# EAGLE design ArduinoStandaloneUsbSwitch-V2 (EAGLE 7.4.0)
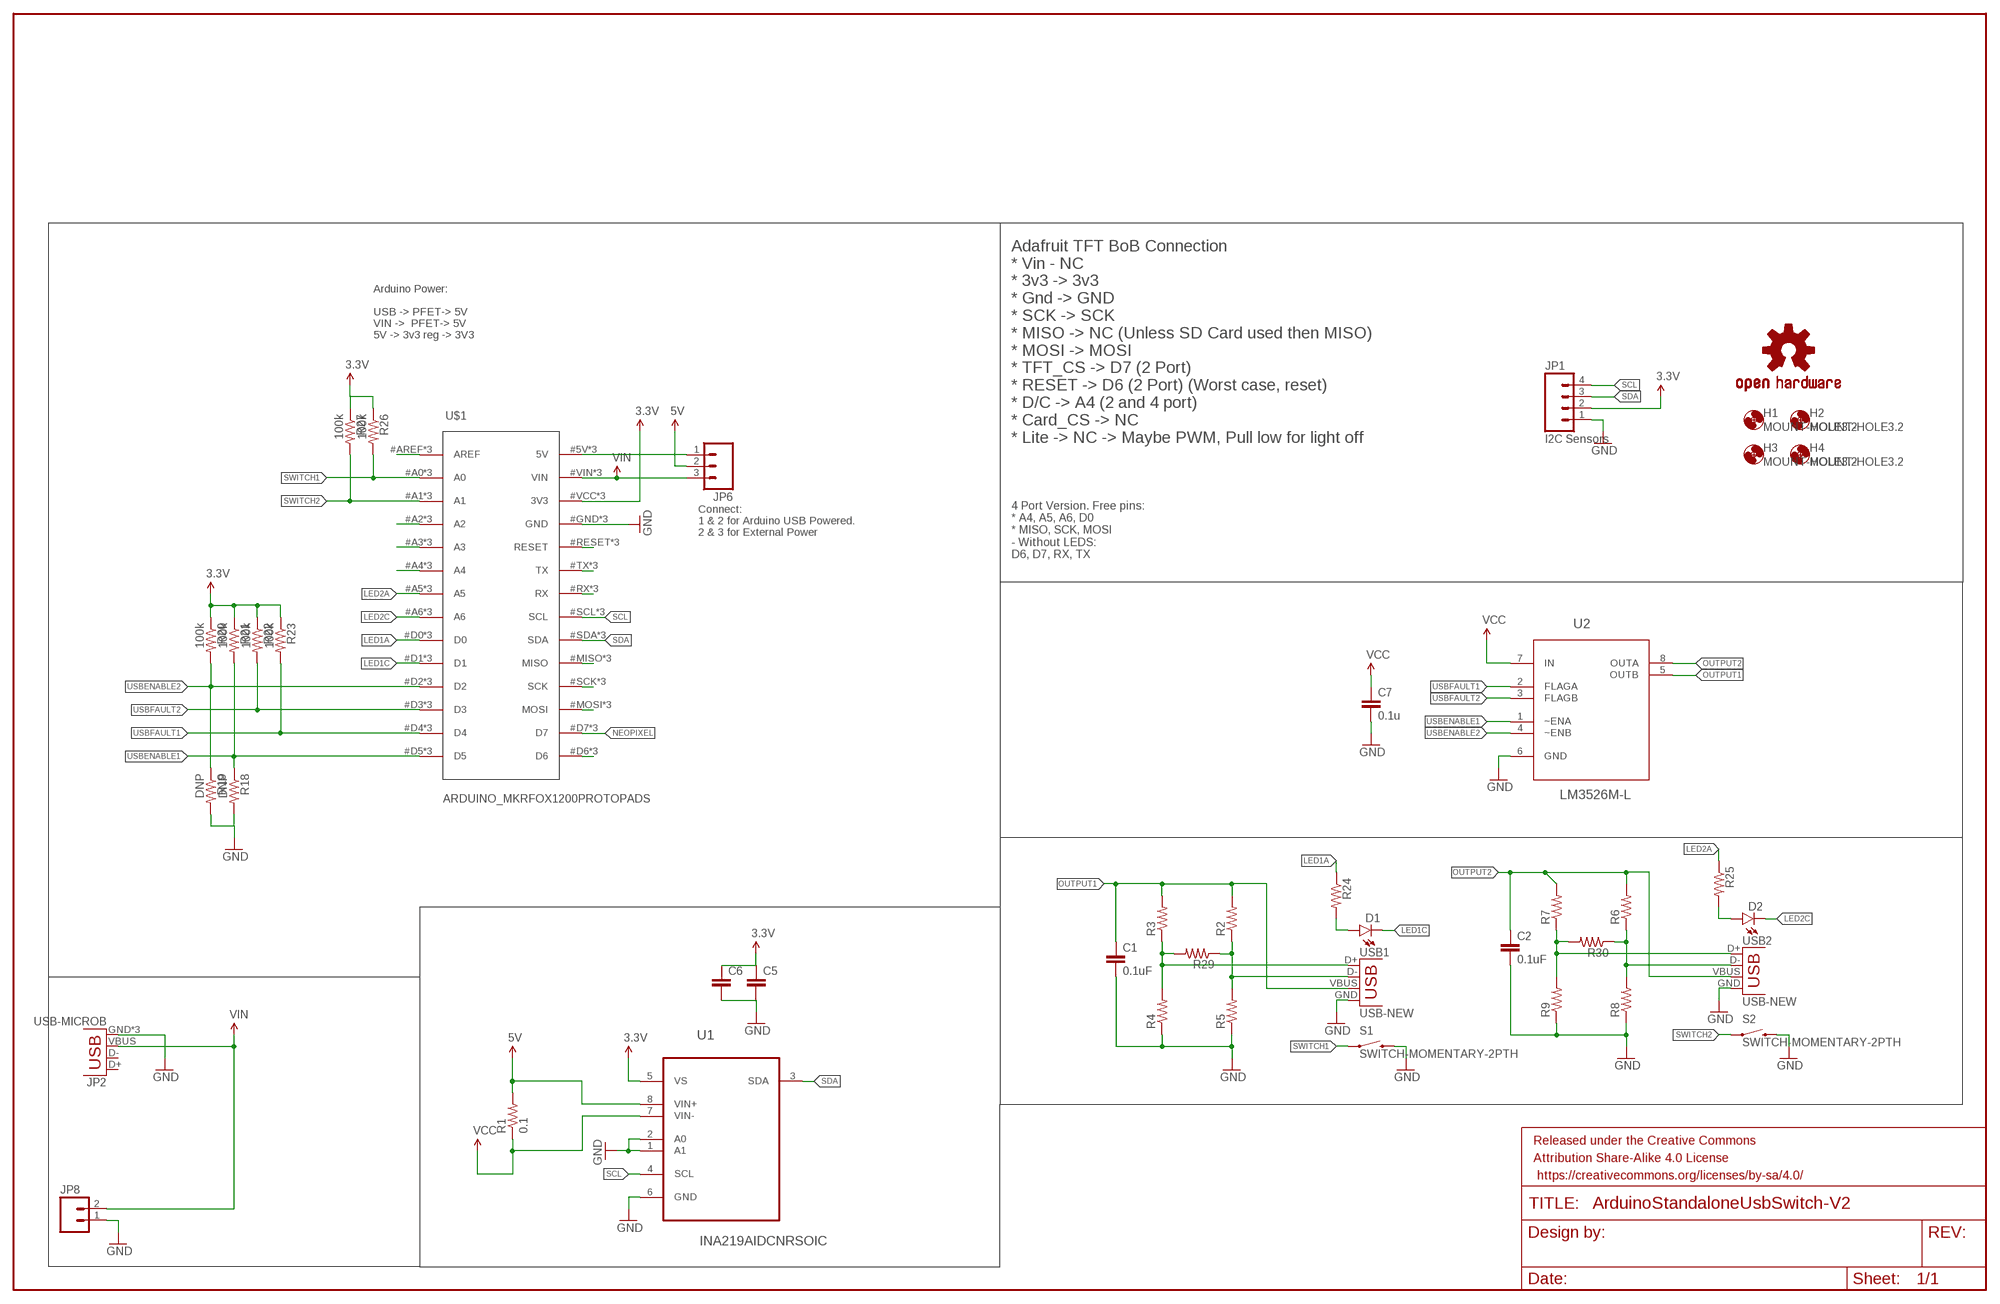
[diagram p0: schematic, sheet 1]

## Parts
C1  0.1uF  CAP0805  [0805]
C2  0.1uF  CAP0805  [0805]
C5  CAP0805  [0805]
C6  CAP0805  [0805]
C7  0.1u  CAP0805  [0805]
D1  LED3MM  [LED3MM]
D2  LED3MM  [LED3MM]
FRAME1  FRAME-LEDGER  [CREATIVE_COMMONS]
H1  MOUNT-HOLE3.2  [3,2]
H2  MOUNT-HOLE3.2  [3,2]
H3  MOUNT-HOLE3.2  [3,2]
H4  MOUNT-HOLE3.2  [3,2]
JP1  I2C Sensors  M04POLAR  [MOLEX-1X4]
JP2  USB-MICROB  [USB-MICROB]
JP6  M03PTH  [1X03]
JP8  M025MM  [SCREWTERMINAL-5MM-2]
LOGO1  OSHW-LOGOM  [OSHW-LOGO-M]
R1  0.1  0.001OHM-3W-1%(2512)3W/1%  [2512]
R2  RESISTOR0805-RES  [0805]
R3  RESISTOR0805-RES  [0805]
R4  RESISTOR0805-RES  [0805]
R5  RESISTOR0805-RES  [0805]
R6  RESISTOR0805-RES  [0805]
R7  RESISTOR0805-RES  [0805]
R8  RESISTOR0805-RES  [0805]
R9  RESISTOR0805-RES  [0805]
R18  DNP  RESISTOR0805-RES  [0805]
R19  DNP  RESISTOR0805-RES  [0805]
R20  100k  RESISTOR0805-RES  [0805]
R21  100k  RESISTOR0805-RES  [0805]
R22  100k  RESISTOR0805-RES  [0805]
R23  100k  RESISTOR0805-RES  [0805]
R24  RESISTOR0805-RES  [0805]
R25  RESISTOR0805-RES  [0805]
R26  100k  RESISTOR0805-RES  [0805]
R27  100k  RESISTOR0805-RES  [0805]
R29  RESISTOR0805-RES  [0805]
R30  RESISTOR0805-RES  [0805]
S1  SWITCH-MOMENTARY-2PTH  [TACTILE-PTH]
S2  SWITCH-MOMENTARY-2PTH  [TACTILE-PTH]
U1  INA219AIDCNRSOIC  [SO08]
U2  LM3526M-L  [SOIC127P640X175-8N]
U$1  ARDUINO_MKRFOX1200PROTOPADS  [ARDUINO_MKRFOX1200_PROTOPADS]
USB1  USB-NEW  [USB-A-VERTICAL]
USB2  USB-NEW  [USB-A-VERTICAL]

## Nets
3.3V: C5.1 C6.1 JP1.2 R20.1 R21.1 R22.1 R23.1 R26.1 R27.1 U1.5(VS) U$1.#VCC(3V3) U$1.@VCC(3V3) U$1.VCC(3V3)
5V: JP6.2 R1.2 U1.8(VIN+)
GND: C1.2 C2.2 C5.2 C6.2 C7.2 JP1.1 JP2.GND JP2.MT1(GND) JP2.MT2(GND) JP8.1 R4.1 R5.1 R8.1 R9.1 R18.2 R19.2 S1.3 S2.3 U1.1(A1) U1.2(A0) U1.6(GND) U2.6(GND) U$1.#GND(GND) U$1.@GND(GND) U$1.GND USB1.GND USB2.GND
LED1A: R24.1 U$1.#D0(D0) U$1.@D0(D0) U$1.D0
LED1C: D1.K(C) U$1.#D1(D1) U$1.@D1(D1) U$1.D1
LED2A: R25.1 U$1.#A5(A5) U$1.@A5(A5) U$1.A5
LED2C: D2.K(C) U$1.#A6(A6) U$1.@A6(A6) U$1.A6
N$3: JP6.1 U$1.5V U$1.#5V(5V) U$1.@5V(5V)
N$4: D1.A R24.2
N$6: D2.A R25.2
N$7: U$1.#RESET(RESET) U$1.@RESET(RESET) U$1.RESET
N$8: U$1.#TX(TX) U$1.@TX(TX) U$1.TX
N$9: U$1.#RX(RX) U$1.@RX(RX) U$1.RX
N$10: R3.1 R4.2 R29.2 USB1.D+
N$11: U$1.#MISO(MISO) U$1.@MISO(MISO) U$1.MISO
N$12: U$1.#SCK(SCK) U$1.@SCK(SCK) U$1.SCK
N$13: R2.1 R5.2 R29.1 USB1.D-
N$14: U$1.#MOSI(MOSI) U$1.@MOSI(MOSI) U$1.MOSI
N$15: U$1.#D6(D6) U$1.@D6(D6) U$1.D6
N$16: U$1.#A4(A4) U$1.@A4(A4) U$1.A4
N$17: U$1.#A3(A3) U$1.@A3(A3) U$1.A3
N$18: R6.1 R8.2 R30.1 USB2.D-
N$19: U$1.#A2(A2) U$1.@A2(A2) U$1.A2
N$20: U$1.#AREF(AREF) U$1.@AREF(AREF) U$1.AREF
NEOPIXEL: U$1.#D7(D7) U$1.@D7(D7) U$1.D7
OUTPUT1: C1.1 R2.2 R3.2 U2.5(OUTB) USB1.VBUS
OUTPUT2: C2.1 R6.2 R7.2 U2.8(OUTA) USB2.VBUS
SCL: JP1.4 U1.4(SCL) U$1.#SCL(SCL) U$1.@SCL(SCL) U$1.SCL
SDA: JP1.3 U1.3(SDA) U$1.#SDA(SDA) U$1.@SDA(SDA) U$1.SDA
SWITCH1: R26.2 S1.1 U$1.#A0(A0) U$1.@A0(A0) U$1.A0
SWITCH2: R27.2 S2.1 U$1.#A1(A1) U$1.@A1(A1) U$1.A1
USB2D-: R7.1 R9.2 R30.2 USB2.D+
USBENABLE1: R18.1 R21.2 U2.1(~ENA) U$1.#D5(D5) U$1.@D5(D5) U$1.D5
USBENABLE2: R19.1 R20.2 U2.4(~ENB) U$1.#D2(D2) U$1.@D2(D2) U$1.D2
USBFAULT1: R23.2 U2.2(FLAGA) U$1.#D4(D4) U$1.@D4(D4) U$1.D4
USBFAULT2: R22.2 U2.3(FLAGB) U$1.#D3(D3) U$1.@D3(D3) U$1.D3
VCC: C7.1 R1.1 U1.7(VIN-) U2.7(IN)
VIN: JP2.VBUS JP6.3 JP8.2 U$1.#VIN(VIN) U$1.@VIN(VIN) U$1.VIN
Unconnected: JP2.D+ JP2.D-

## Notes on the sheet
- Arduino Power: 
  
  USB -> PFET-> 5V
  VIN ->  PFET-> 5V
  5V -> 3v3 reg -> 3V3
- Adafruit TFT BoB Connection
  * Vin - NC
  * 3v3 -> 3v3
  * Gnd -> GND
  * SCK -> SCK
  * MISO -> NC (Unless SD Card used then MISO)
  * MOSI -> MOSI
  * TFT_CS -> D7 (2 Port)
  * RESET -> D6 (2 Port) (Worst case, reset)
  * D/C -> A4 (2 and 4 port)
  * Card_CS -> NC
  * Lite -> NC -> Maybe PWM, Pull low for light off
- Connect:
  1 & 2 for Arduino USB Powered.
  2 & 3 for External Power
- 4 Port Version. Free pins:
  * A4, A5, A6, D0
  * MISO, SCK, MOSI
  - Without LEDS:
  D6, D7, RX, TX

## Library data of the parts
C1 C2 C5-C7 = SparkFun-Capacitors:CAP: Capacitor Standard 0603 ceramic capacitor, and 0.1" leaded capacitor.
D1 D2 = SparkFun-LED:LED: LEDs Standard schematic elements and footprints for 5mm, 3mm, 1206, and 0603 sized LEDs. 5mm - Spark Fun Electronics SKU : COM-00529 (and others)
FRAME1 = SparkFun-Aesthetics:FRAME-LEDGER: Schematic Frame Standard 11x14 US Ledger frame
H1-H4 = holes:MOUNT-HOLE: MOUNTING HOLE with drill center marker
JP1 = SparkFun-Connectors:M04: Header 4 Standard 4-pin 0.1" header. Use with straight break away headers (SKU : PRT-00116), right angle break away headers (PRT-00553), swiss pins (PRT-00743), machine pins (PRT-00117), and female headers (PRT-00115). Molex polarized connector foot print use with SKU : PRT-08231 with associated crimp pins and housings. 1MM SMD Version SKU: PRT-10208
JP2 = SparkFun-Connectors:USB: USB Connectors USB-B-PTH is fully proven SKU : PRT-00139/CONN-08278 USB-miniB is fully proven SKU : PRT-00587 USB-A-PCB is untested. USB-A-H is throughly reviewed, but untested. Spark Fun Electronics SKU : PRT-00437 USB-B-SMT is throughly reviewed, but untested. Needs silkscreen touching up. USB-A-S has not been used/tested USB-MB-H has not been used/tested USB-MICROB has been used. CONN-09505; PROD_ID: CONN-09505
JP6 = SparkFun-Connectors:M03: Header 3 Standard 3-pin 0.1" header. Use with straight break away headers (SKU : PRT-00116), right angle break away headers (PRT-00553), swiss pins (PRT-00743), machine pins (PRT-00117), and female headers (PRT-00115). Molex polarized connector foot print use with SKU : PRT-08232 with associated crimp pins and housings.
JP8 = SparkFun-Connectors:M02: Standard 2-pin 0.1" header. Use with - straight break away headers ( PRT-00116) - right angle break away headers (PRT-00553) - swiss pins (PRT-00743) - machine pins (PRT-00117) - female headers (PRT-00115) Molex polarized connector foot print use with: PRT-08233 with associated crimp pins and housings. 2.54_SCREWTERM for use with PRT-10571. 3.5mm Screw Terminal footprints for PRT-08084 5mm Screw Terminal footprints for use with PRT-08432; STOREFRONT_ID: PRT-08432
LOGO1 = SparkFun-Aesthetics:OSHW-LOGO: Open Source Hardware Logo This logo indicates the piece of hardware it is found on incorporates a OSHW license and/or adheres to the definition of open source hardware found here: http://freedomdefined.org/OSHW
R1 = SparkFun-Resistors:0.001OHM-3W-1%(2512); PROD_ID: RES-12449; VALUE: 0.001
R2-R9 R18-R27 R29 R30 = SparkFun-Resistors:RESISTOR: Resistor Basic schematic elements and footprints for 0603, 1206, and PTH resistors.
S1 S2 = SparkFun-Electromechanical:SWITCH-MOMENTARY-2: Various NO switches- pushbuttons, reed, etc; PROD_ID: SWCH-08441
U1 = INA219AIDCNR:INA219AIDCNR: CURRENT/POWER MONITOR
U2 = LM3256M-L:LM3526M-L: Dual Port USB Power Switch; MPN: LM3526M-L; OC_FARNELL: 1469238; OC_NEWARK: 41K4868; PACKAGE: SOIC-8; SUPPLIER: National Semiconductor
U$1 = Arduino:ARDUINO_MKRFOX1200
USB1 USB2 = Tinamous:USB-NEW: USB Connectors USB-B-PTH is fully proven SKU : PRT-00139/CONN-08278 USB-miniB is fully proven SKU : PRT-00587 USB-A-PCB is untested. USB-A-H is throughly reviewed, but untested. Spark Fun Electronics SKU : PRT-00437 USB-B-SMT is throughly reviewed, but untested. Needs silkscreen touching up. USB-A-S has not been used/tested USB-MB-H has not been used/tested USB-MICROB has been used. CONN-09505

## Board
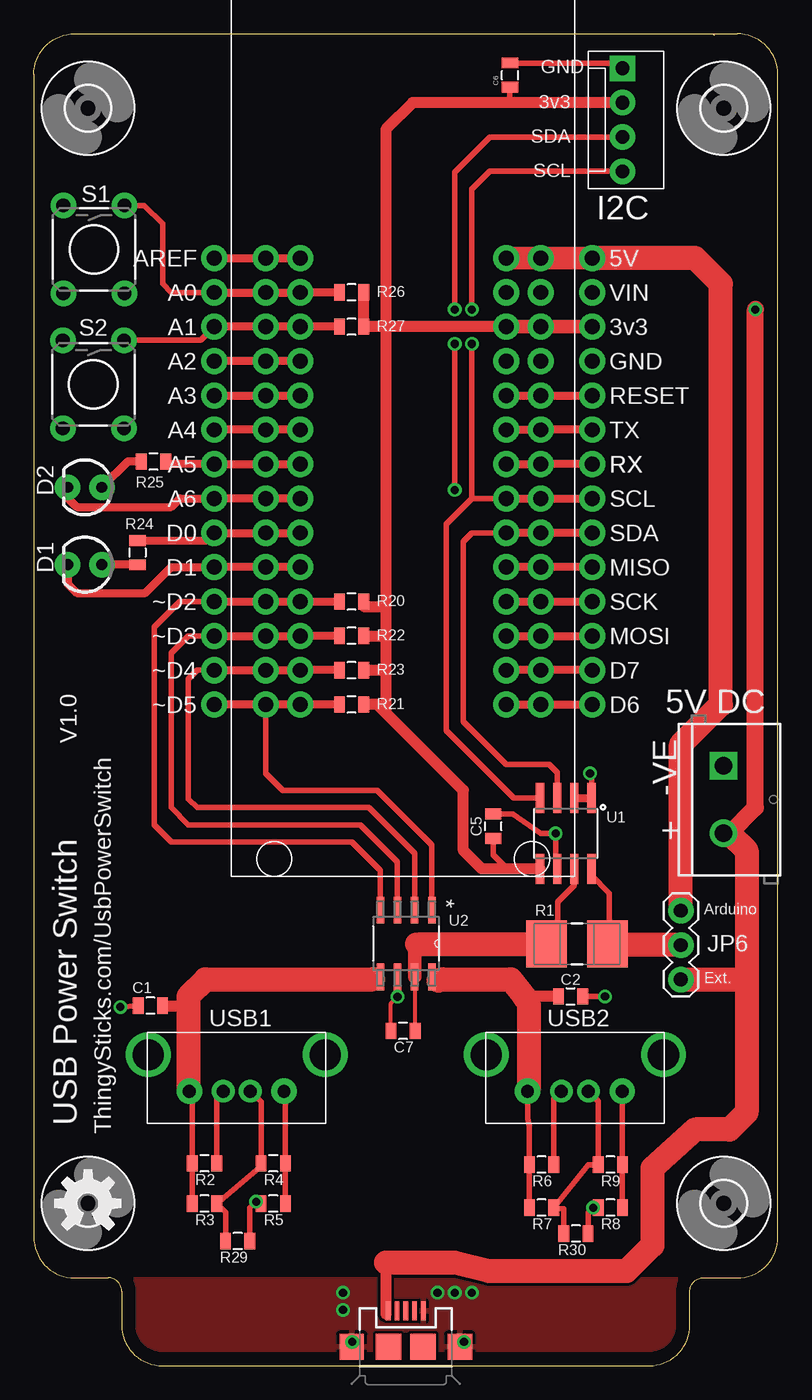
[diagram p1: board, top side]
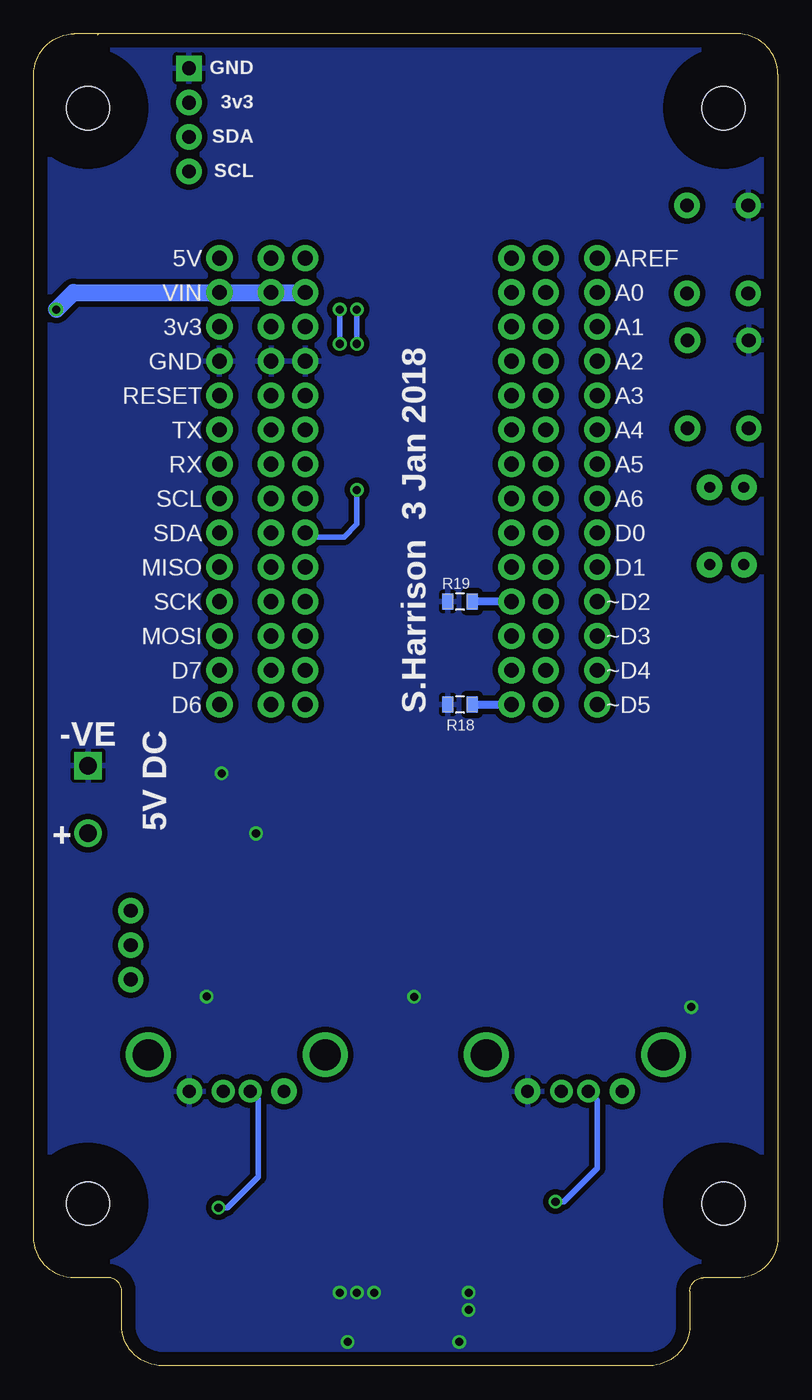
[diagram p2: board, bottom side, seen from below]

Size 55 x 98.5 mm. Coordinates in mm from the lower left corner, seen from the top.
Outline: 49.5,98.5 52,98.5 arc-90 55,95.5 55,9.5 arc-90 52,6.5 49.5,6.5 arc90 48.5,5.5 48.5,3 arc-90 45.5,0 9.5,0 arc-90 6.5,3 6.5,5.5 arc90 5.5,6.5 3,6.5 arc-90 0,9.5 0,95.5 arc-90 3,98.5 50.2,98.5 50.3,98.4
Copper layers (1*16): Top 0.035mm / dielectric 1.5mm / Bottom 0.035mm
Design rules "default": minimum track width 10mil, minimum drill 24mil, track to track 8mil, track to pad 8mil, pad to pad 8mil, via to via 8mil, smd to smd 8mil, copper to edge 40mil, drill to drill 8mil, minimum pad ring 10mil, minimum via ring 8mil, stop-mask expansion 4mil, vias tented up to drill 0mil, thermal gap 10mil

### Footprints (pad centres in the part's own frame; a part is rotated, then mirrored left to right if it is on the bottom)
0805 = smd 0.8 x 1.2: 1 -0.9,0; 2 0.9,0
LED3MM = drill 0.813 pad 1.88: A -1.27,0; K 1.27,0
3,2 = hole 3.2: 0,0
MOLEX-1X4 = drill 1.016 pad 1.88 square: 1 0,0 | drill 1.016 pad 1.88: 2 2.54,0; 3 5.08,0; 4 7.62,0
USB-MICROB = smd 0.35 x 1.4: D+ 0,2.65; D- -0.65,2.65; GND 1.3,2.65; ID 0.65,2.65; VBUS -1.3,2.65 | smd 1.8 x 1.9: MT1 -4,0; MT2 4,0 | smd 1.9 x 1.9: P$1 -1.27,0; P$2 1.27,0
1X03 = drill 1.016 pad 1.88: 1 0,0; 2 2.54,0; 3 5.08,0
SCREWTERMINAL-5MM-2 = drill 1.3 pad 2.032 square: 1 0,0 | drill 1.3 pad 2.032: 2 5,0
2512 = smd 3 x 3.5: 1 -2.25,0; 2 2.25,0
TACTILE-PTH = drill 1.016 pad 1.88: 1 -3.251,2.261; 2 3.251,2.261; 3 -3.251,-2.261; 4 3.251,-2.261
SO08 = smd 0.61 x 2.21: 1 -1.905,-2.616; 2 -0.635,-2.616; 3 0.635,-2.616; 4 1.905,-2.616; 5 1.905,2.616; 6 0.635,2.616; 7 -0.635,2.616; 8 -1.905,2.616
SOIC127P640X175-8N = smd 1.981 x 0.559: 1 -2.464,1.905; 2 -2.464,0.635; 3 -2.464,-0.635; 4 -2.464,-1.905; 5 2.464,-1.905; 6 2.464,-0.635; 7 2.464,0.635; 8 2.464,1.905
ARDUINO_MKRFOX1200_PROTOPADS = drill 1.1 pad 1.93: 5V 22.86,45.72; #5V 20.32,45.72; #A0 5.08,43.18; #A1 5.08,40.64; #A2 5.08,38.1; #A3 5.08,35.56; #A4 5.08,33.02; #A5 5.08,30.48; #A6 5.08,27.94; #AREF 5.08,45.72; #D0 5.08,25.4; #D1 5.08,22.86; #D2 5.08,20.32; #D3 5.08,17.78; #D4 5.08,15.24; #D5 5.08,12.7; #D6 20.32,12.7; #D7 20.32,15.24; #GND 20.32,38.1; #MISO 20.32,22.86; #MOSI 20.32,17.78; #RESET 20.32,35.56; #RX 20.32,30.48; #SCK 20.32,20.32; #SCL 20.32,27.94; #SDA 20.32,25.4; #TX 20.32,33.02; #VCC 20.32,40.64; #VIN 20.32,43.18; @5V 26.67,45.72; @A0 -1.27,43.18; @A1 -1.27,40.64; @A2 -1.27,38.1; @A3 -1.27,35.56; @A4 -1.27,33.02; @A5 -1.27,30.48; @A6 -1.27,27.94; @AREF -1.27,45.72; @D0 -1.27,25.4; @D1 -1.27,22.86; @D2 -1.27,20.32; @D3 -1.27,17.78; @D4 -1.27,15.24; @D5 -1.27,12.7; @D6 26.67,12.7; @D7 26.67,15.24; @GND 26.67,38.1; @MISO 26.67,22.86; @MOSI 26.67,17.78; @RESET 26.67,35.56; @RX 26.67,30.48; @SCK 26.67,20.32; @SCL 26.67,27.94; @SDA 26.67,25.4; @TX 26.67,33.02; @VCC 26.67,40.64; @VIN 26.67,43.18; A0 2.54,43.18; A1 2.54,40.64; A2 2.54,38.1; A3 2.54,35.56; A4 2.54,33.02; A5 2.54,30.48; A6 2.54,27.94; AREF 2.54,45.72; D0 2.54,25.4; D1 2.54,22.86; D2 2.54,20.32; D3 2.54,17.78; D4 2.54,15.24; D5 2.54,12.7; D6 22.86,12.7; D7 22.86,15.24; GND 22.86,38.1; MISO 22.86,22.86; MOSI 22.86,17.78; RESET 22.86,35.56; RX 22.86,30.48; SCK 22.86,20.32; SCL 22.86,27.94; SDA 22.86,25.4; TX 22.86,33.02; VCC 22.86,40.64; VIN 22.86,43.18
USB-A-VERTICAL = drill 0.95 pad 1.676: D+ 2.7,1; D- 2.7,-1 | drill 0.95 pad 1.88: GND 2.7,3.5; VBUS 2.7,-3.5 | drill 2.3: SHLD1 0,-6.55; SHLD2 0,6.55

### Placement (x,y rotation side)
C1  8.62,26.62 180 top
C2  39.69,27.3 0 top
C5  33.97,39.9 90 top
C6  35.2,95.44 90 top
C7  27.3,24.77 180 top
D1  3.77,59.24 180 top
D2  3.77,64.96 180 top
FRAME1  -1.27,-10.16 0 top  (outside the outline)
H1  51,12 0 top
H2  4,12 0 top
H3  51,93 0 top
H4  4,93 0 top
JP1  43.53,95.95 270 top
JP2  27.5,1.4 0 top
JP6  47.84,33.65 270 top
JP8  50.98,44.38 270 top
LOGO1  4,12 0 top
R1  40.16,31.2 0 top
R2  12.62,14.96 180 top
R3  12.62,11.99 180 top
R4  17.7,14.96 180 top
R5  17.7,11.99 180 top
R6  37.54,14.87 180 top
R7  37.54,11.69 180 top
R8  42.62,11.69 180 top
R9  42.62,14.87 180 top
R18  23.5,48.9 180 bottom
R19  23.5,56.52 180 bottom
R20  23.5,56.52 180 top
R21  23.5,48.9 180 top
R22  23.5,53.98 180 top
R23  23.5,51.44 180 top
R24  7.66,60.13 270 top
R25  8.85,66.86 180 top
R26  23.5,79.38 180 top
R27  23.5,76.83 180 top
R29  15.07,9.22 180 top
R30  40.08,9.78 180 top
S1  4.45,82.55 270 top
S2  4.41,72.58 270 top
U1  39.33,39.37 180 top
U2  27.52,31.22 270 top
U$1  14.61,36.2 0 top
USB1  15,23 270 top
USB2  40,23 270 top

### Tracks (layer width: path | path; a pad name or v marks a point on that pad's centre or on a via)
3.3V
  Top 0.305: 24.19,56.77 R20.1 24.45,56.14
  Top 0.406: C5.1 33.97,37.78 34.92,36.83 37.34,36.83 U1.5 | C6.1 35.2,93.68 34.92,93.41
  Top 0.813: U1.5 33.1,36.75 31.75,38.1 31.75,42.55 26.04,48.26 | 26.04,48.26 25.4,48.9 R21.1 | U$1.#VCC 26.04,76.83 | 26.04,76.83 26.04,55.88 | 26.04,55.88 26.04,53.98 | 26.04,53.98 26.04,51.44 | 26.04,51.44 26.04,48.26 | R23.1 26.04,51.44 | R22.1 26.04,53.98 | 24.45,56.14 25.77,56.14 26.04,55.88 | 26.04,76.83 R27.1 R26.1 | JP1.2 34.92,93.41 28,93.41 26.04,91.44 26.04,76.83
  Top 1.016: U$1.#VCC U$1.VCC U$1.@VCC
5V
  Top 0.406: U1.8 41.23,36.24 42.55,34.92 42.55,31.33 R1.2
  Top 1.778: JP6.2 42.41,31.11 R1.2
GND  (via drill 0.6)
  Top 0.305: 23.7,1.61 23.7,1.7 23.5,1.91 23.5,1.27 | C7.2 26.41,26.8 v26.89,27.29
  Top 0.406: R5.1 R4.1 18.6,20.2 USB1.GND | R8.1 R9.1 43.52,15.38 43.5,15.74 USB2.GND | C2.2 v42.23,27.3 | C1.2 v6.4,26.53 | U1.6 38.58,36.86 v38.58,39.36 38.56,39.37 37.47,39.37 35.4,40.8 C5.2 | 40.01,41.94 U1.2 | 41.3,41.91 U1.1 41.23,43.69 v41.12,43.8 | C6.2 43.14,96.34 JP1.1
  Top 0.61: U1.2 U1.1 | U2.6 v26.89,27.29
  Top 1.016: JP2.MT1 23.7,1.61 v23.55,1.76 | v31.8,1.76 31.8,1.5 JP2.MT2
  other vias: 29.84,5.4 31.11,5.4 22.86,5.4 22.86,4.13 32.38,5.4
  pour Bottom (isolate 0.406, rank 6): -0.37,105.77 55.18,105.63 55.38,-0.34 -0.37,-0.44
  pour Top: 4.45,0 4.45,6.35 49.53,6.35 49.53,0
LED1A
  Top 0.61: U$1.#D0 U$1.D0 U$1.@D0 12.78,61.03 R24.1
LED1C
  Top 0.61: U$1.#D1 U$1.D1 U$1.@D1 10.16,59.05 8.26,57.15 3.17,57.15 2.5,57.83 D1.K
LED2A
  Top 0.61: U$1.#A5 U$1.A5 U$1.@A5 9.94,66.67 R25.1
LED2C
  Top 0.61: U$1.#A6 U$1.A6 U$1.@A6 10.79,64.14 10.16,63.5 3.17,63.5 2.5,64.17 D2.K
N$3
  Top 1.676: U$1.#5V U$1.5V U$1.@5V
  Top 1.778: JP6.1 47.84,45.93 50.8,48.9 50.8,80.01 48.9,81.92 U$1.@5V
N$4
  Top 0.61: R24.2 D1.A
N$6
  Top 0.61: R25.2 6.95,66.86 D2.A
N$7
  Top 0.61: U$1.#RESET U$1.RESET U$1.@RESET
N$8
  Top 0.61: U$1.#TX U$1.TX U$1.@TX
N$9
  Top 0.61: U$1.#RX U$1.RX U$1.@RX
N$10
  Top 0.406: R29.2 14.18,11.34 R3.1 16.7,14.66 R4.2 16.8,19.5 USB1.D+
N$11
  Top 0.61: U$1.@MISO U$1.MISO U$1.#MISO
N$12
  Top 0.61: U$1.#SCK U$1.SCK U$1.@SCK
N$13  (via drill 0.6)
  Top 0.406: R5.2 v16.43,12.12 15.97,11.67 R29.1 | R2.1 13.52,19.82 USB1.D-
  Bottom 0.406: v16.43,12.12 15.81,12.12 13.34,14.61 13.34,19.64 USB1.D-
N$14
  Top 0.61: U$1.#MOSI U$1.MOSI U$1.@MOSI
N$15
  Top 0.61: U$1.#D6 U$1.D6 U$1.@D6
N$16
  Top 0.61: U$1.#A4 U$1.A4 U$1.@A4
N$17
  Top 0.61: U$1.@A3 U$1.A3 U$1.#A3
N$18  (via drill 0.6)
  Top 0.406: R8.2 v41.35,11.69 40.98,11.31 R30.1 | R6.1 38.44,19.74 USB2.D-
  Bottom 0.406: v41.35,11.69 40.7,11.69 38.42,13.97 38.42,19.72 USB2.D-
N$19
  Top 0.61: U$1.#A2 U$1.A2 U$1.@A2
N$20
  Top 0.61: U$1.@AREF U$1.AREF U$1.#AREF
NEOPIXEL
  Top 0.61: U$1.@D7 U$1.D7 U$1.#D7
OUTPUT1
  Top 0.406: R3.2 R2.2 11.72,20.08 USB1.VBUS
  Top 0.61: 25.08,28.57 25.43,28.57 U2.5
  Top 0.813: C1.1 11.38,26.62 11.43,26.67
  Top 1.778: 25.08,28.57 12.7,28.57 11.43,27.3 11.43,26.67 11.43,20.37 USB1.VBUS
OUTPUT2
  Top 0.406: R7.2 R6.2 36.64,17.72 36.5,18.28 USB2.VBUS
  Top 0.61: U2.8 30.56,28.3 29.93,28.48
  Top 0.813: C2.1 36.51,27.3 36.35,27.15
  Top 1.778: 29.93,28.48 30.16,28.57 35.24,28.57 36.35,27.15 36.55,26.95 36.6,26.63 36.6,20.52 USB2.VBUS
SCL  (via drill 0.6)
  Top 0.406: U1.4 35.49,41.98 30.48,46.99 30.48,62.23 32.38,64.14 | 32.38,64.14 U$1.#SCL | JP1.4 33.72,88.33 32.38,87 v32.38,78.11 | v32.38,75.56 32.38,64.14
  Top 0.61: U$1.#SCL U$1.SCL U$1.@SCL
  Bottom 0.406: v32.38,78.11 v32.38,75.56
SDA  (via drill 0.6)
  Top 0.406: U1.3 38.69,43.86 38.1,44.45 34.92,44.45 31.75,47.62 31.75,60.96 32.38,61.59 U$1.#SDA | JP1.3 33.72,90.87 31.11,88.27 v31.11,78.11 | v31.11,75.56 v31.11,64.77
  Top 0.61: U$1.@SDA U$1.SDA U$1.#SDA
  Bottom 0.406: v31.11,78.11 v31.11,75.56 | v31.11,64.77 31.11,62.23 32.07,61.28 34.61,61.28 U$1.#SDA
SWITCH1
  Top 0.406: S1.1 8.18,85.8 9.53,84.45 9.53,80.01 10.16,79.38 U$1.@A0
  Top 0.61: U$1.@A0 U$1.A0 U$1.#A0 R26.2
SWITCH2
  Top 0.406: S2.1 12.33,75.83 U$1.@A1
  Top 0.61: U$1.@A1 U$1.A1 U$1.#A1 R27.2
USB2D-
  Top 0.406: R30.2 39.17,11.59 R7.1 40.98,14.87 R9.2 41.74,17.72 41.74,19.56 USB2.D+
USBENABLE1
  Top 0.406: U2.1 29.43,38.52 25.4,42.55 18.41,42.55 17.14,43.81 U$1.D5
  Top 0.61: U$1.@D5 U$1.D5 U$1.#D5 R21.2
  Bottom 0.61: R21.2 U$1.#D5
USBENABLE2
  Top 0.406: U2.4 25.61,36.62 23.5,38.73 10.16,38.73 8.89,40.01 8.89,54.61 10.79,56.52 U$1.@D2
  Top 0.61: U$1.@D2 U$1.D2 U$1.#D2 R20.2
  Bottom 0.61: U$1.#D2 R20.2
USBFAULT1
  Top 0.406: U2.2 28.16,37.88 24.77,41.27 12.06,41.27 11.43,41.91 11.43,50.8 12.06,51.44 U$1.@D4
  Top 0.61: U$1.@D4 U$1.D4 U$1.#D4 R23.2
USBFAULT2
  Top 0.406: U2.3 26.89,37.25 24.13,40.01 11.43,40.01 10.16,41.27 10.16,52.7 11.43,53.98 U$1.@D3
  Top 0.61: U$1.@D3 U$1.D3 U$1.#D3 R22.2
VCC
  Top 0.305: C7.1 28.2,28.71 U2.7
  Top 0.406: U1.7 39.96,35.52 38.73,34.29 38.73,32.02 R1.1
  Top 1.016: U2.7 28.16,30.76 28.57,31.18
  Top 1.676: 28.25,31.18 28.57,31.18
  Top 1.778: 28.57,31.18 37.89,31.18 R1.1
VIN  (via drill 0.6)
  Top 0.406: 26.04,3.81 26.16,3.81 JP2.VBUS
  Top 0.813: 26.04,7.62 26.04,3.81
  Top 1.27: JP8.2 51.44,39.38 53.34,41.27 v53.34,78.11
  Top 1.778: JP6.3 50.81,28.57 52.7,28.57 | 52.7,28.57 52.7,18.73 51.44,17.46 48.9,17.46 45.72,14.61 45.72,8.89 43.81,6.99 33.66,6.99 31.11,7.62 26.04,7.62 | JP8.2 51.43,39.38 52.7,38.1 52.7,28.57
  Bottom 1.27: v53.34,78.11 52.07,79.38 U$1.@VIN U$1.VIN U$1.#VIN

### Text on the board
tNames: GND | 3v3 | SDA | SCL | I2C | 5V DC | V1.0 | -VE | + | Arduino | Ext. | USB Power Switch | ThingySticks.com/UsbPowerSwitch
bNames: USB Power Switch | GND | 3v3 | SDA | SCL | S.Harrison 3 Jan 2018 | -VE | 5V DC | +